# EAGLE schematic skylift-02_logo (EAGLE 6.4)
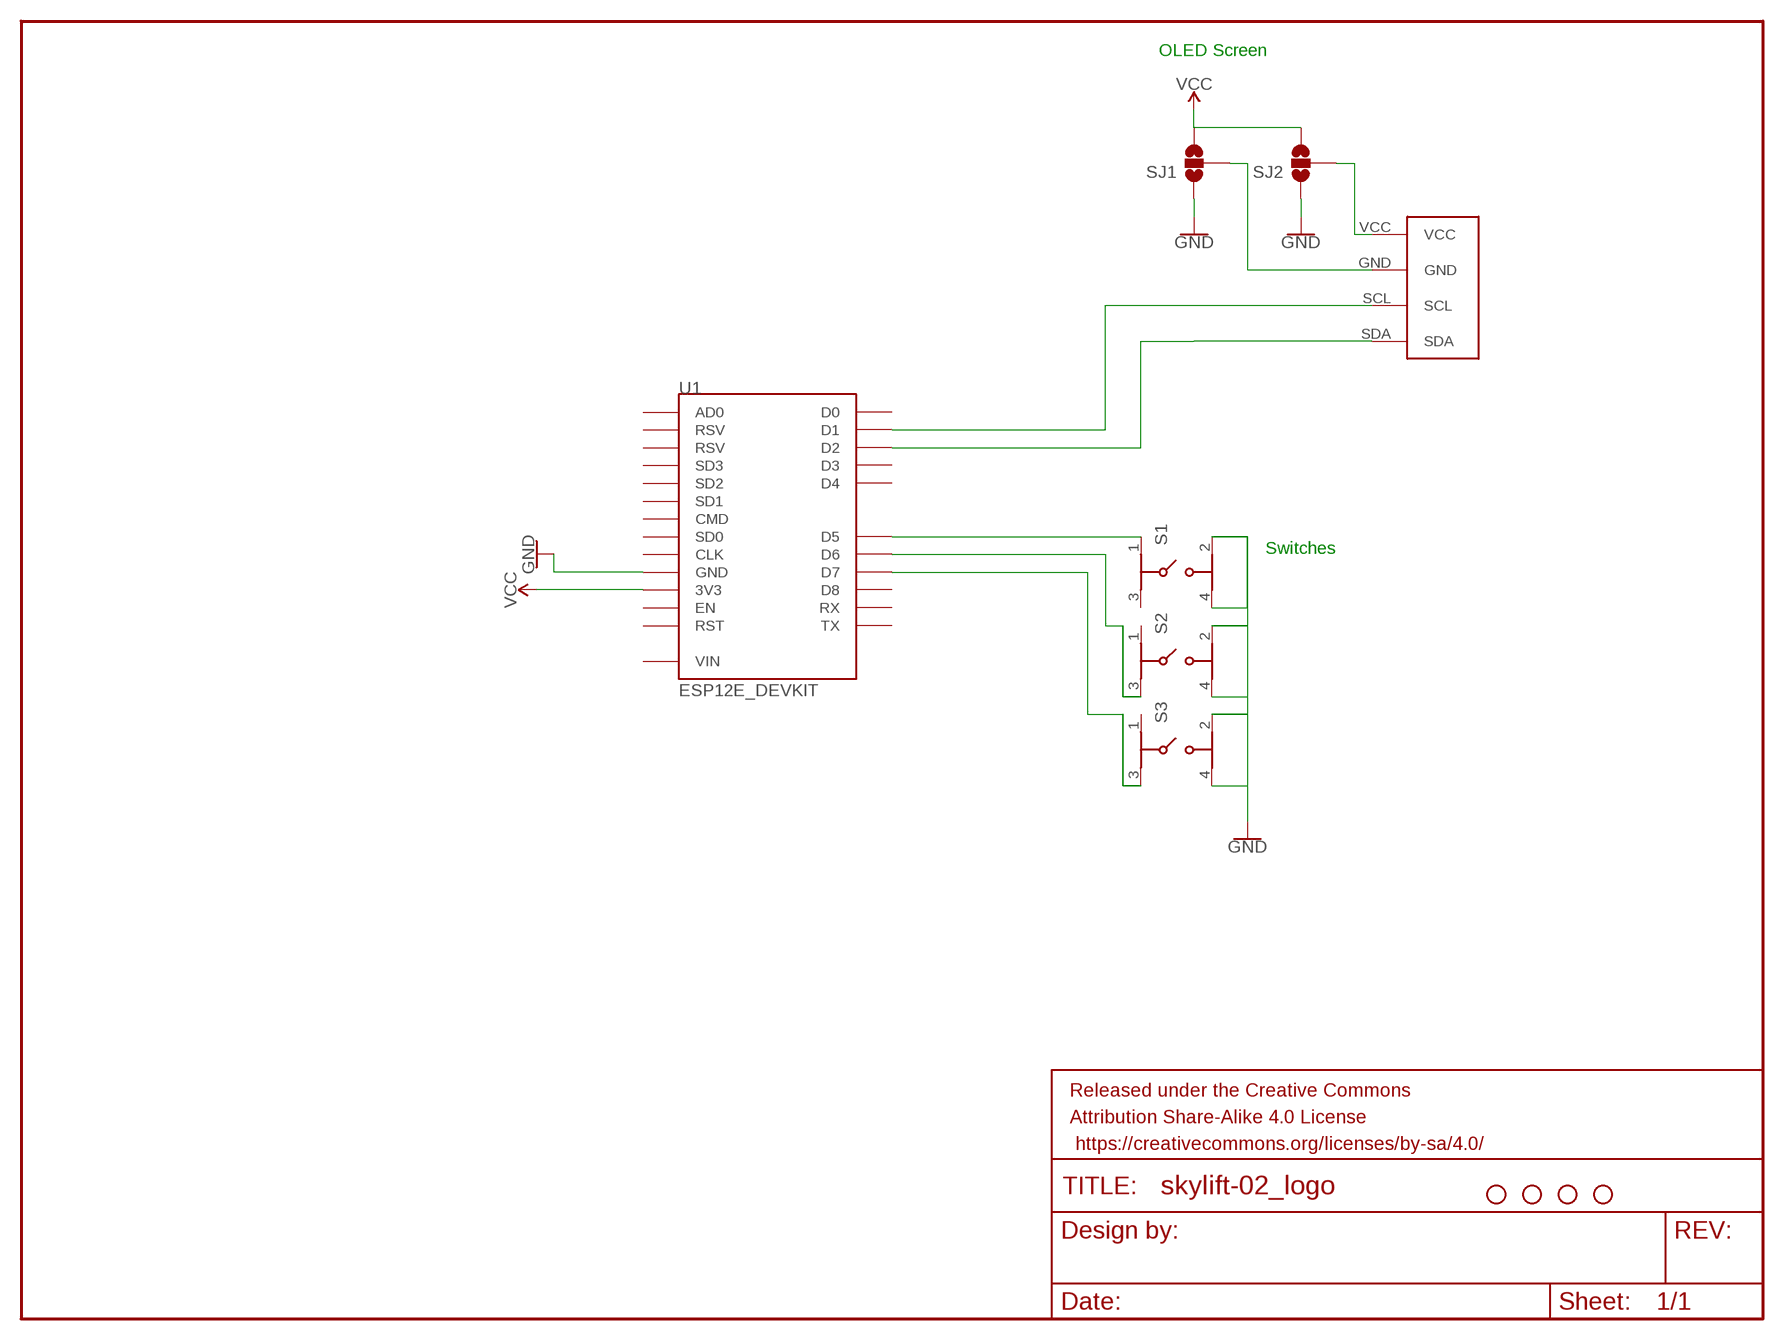
[diagram p0: schematic, sheet 1]

## Parts
FRAME1  FRAME-LETTERNO_PACKAGE  [DUMMY]
H1  STAND-OFFTIGHT  [STAND-OFF-TIGHT]
H2  STAND-OFFTIGHT  [STAND-OFF-TIGHT]
H3  STAND-OFFTIGHT  [STAND-OFF-TIGHT]
H4  STAND-OFFTIGHT  [STAND-OFF-TIGHT]
S1  436333045822  [436333045822]
S2  436333045822  [436333045822]
S3  436333045822  [436333045822]
SJ1  SOLDERJUMPER_2WAY-OLDT  [SJ_2]
SJ2  SOLDERJUMPER_2WAY-OLDT  [SJ_2]
U1  ESP12E_DEVKIT  [ESP12E_DEVKIT]
U2  I2C_OLED  [I2C_OLED_PACKAGE]

## Nets
D5: S1.1 U1.D5
D6: S2.3 U1.D6
D7: S3.3 U1.D7
GND: S1.2 S1.4 S2.2 S2.4 S3.2 S3.4 SJ1.1 SJ2.1 U1.GND@0(GND) U1.GND@1(GND) U1.GND@2(GND) U1.GND@3(GND)
N$4: SJ1.2 U2.GND
N$5: SJ2.2 U2.VCC
SCL: U1.D1 U2.SCL
SDA: U1.D2 U2.SDA
VCC: SJ1.3 SJ2.3 U1.3V3@0(3V3) U1.3V3@1(3V3) U1.3V3@2(3V3)
Unconnected: S1.3 S2.1 S3.1 U1.AD0 U1.CLK U1.CMD U1.D0 U1.D3 U1.D4 U1.D8 U1.EN U1.RST U1.RSV@0(RSV) U1.RSV@1(RSV) U1.RX U1.SD0 U1.SD1 U1.SD2 U1.SD3 U1.TX

## Notes on the sheet
- OLED Screen
- Switches

## Power pins joined to a net without a drawn wire
VIN: U1.VIN

## Library data of the parts
FRAME1 = SparkFun-Aesthetics:FRAME-LETTER: Schematic Frame - Letter Standard 8.5x11 US Letter frame; DESIGNER: Nobody; VERSION: v01
H1-H4 = SparkFun-Hardware:STAND-OFF: Stand Off Drill holes for mechanically mounting via screws, standoffs, etc. Note: Use the keepout ring to avoid running the screw head into surrounding components. Variant Overviews STAND-OFF - Mechanical footprint for a #4 phillips button head screw. STAND-OFF-TIGHT - Mechanical footprint for a #4 phillips button head screw, Example SparkFun Products Screw - Phillips Head (1/4", 4-40, 10 pack) <https://www.sparkfun.com/products/10453> (PRT-10453) Screw - Phillips Head (1/2", 4-40, 10 pack) <https://www.sparkfun.com/products/10452> (PRT-10452) Screw - Phillips Head (3/4", 4-40, 10 pack) <https://www.sparkfun.com/products/10451> (PRT-10451) Screw - Phillips Head (1", 4-40, 10 pack) <https://www.sparkfun.com/products/10450> (PRT-10450)
S1-S3 = Eagle_SWITCHES (rev17e):436333045822: 3.5x4.7 mm SMD J-Bend side push, boss design WS-TASU <http://katalog.we-online.de/media/images/v2/Family_WS_TUS_Normal_SMD_J-Bend_4363x30458xx_pf2.jpg> Details see: http://katalog.we-online.de/em/datasheet/4363x30458xx.pdf 2015 (C) Wurth Elektronik
SJ1 SJ2 = SparkFun-Retired:SOLDERJUMPER_2WAY-OLD: Solder Jumper 2 way solder jumper
U1 = ESP12E_DEVKIT:ESP12E_DEVKIT: ESP12E DEVKIT BOARD
U2 = DIYMall_OLED:I2C_OLED